# EAGLE design LFO (EAGLE 5.11)

## Sheet 1 of 2
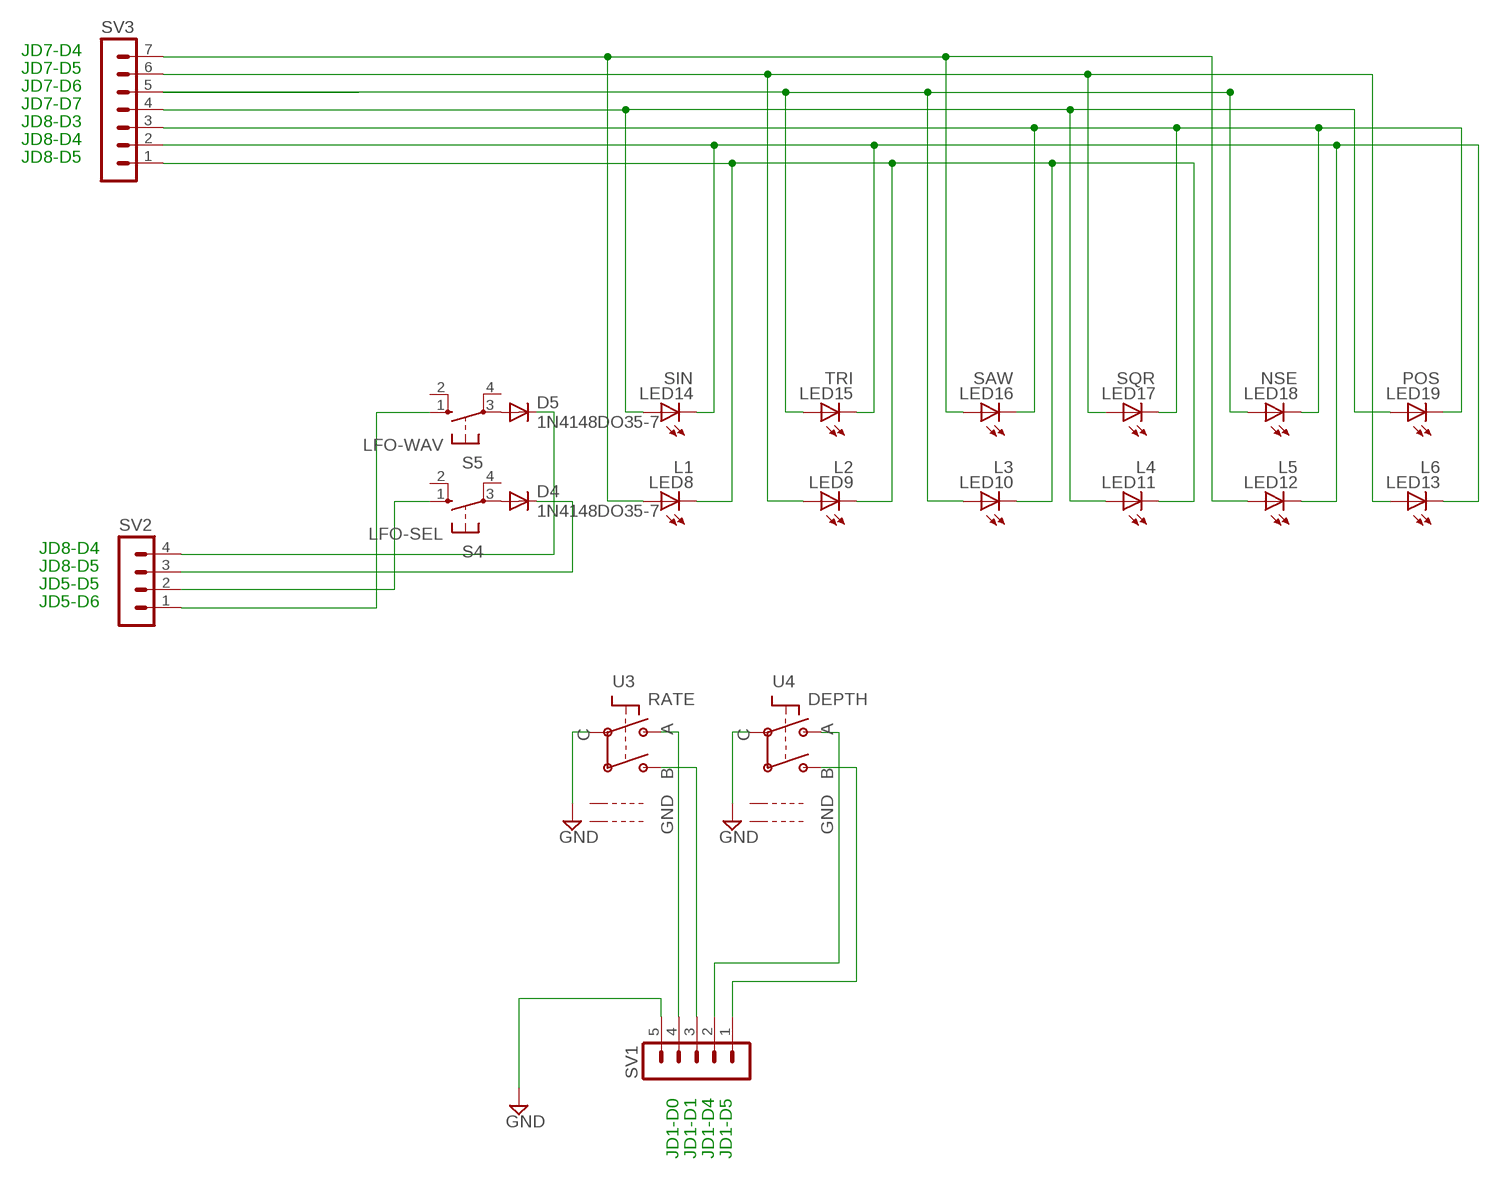
[diagram p0: schematic, sheet 1]

### Parts
D4  1N4148DO35-7  [DO35-7]
D5  1N4148DO35-7  [DO35-7]
LED8  L1  LED3MM  [LED3MM]
LED9  L2  LED3MM  [LED3MM]
LED10  L3  LED3MM  [LED3MM]
LED11  L4  LED3MM  [LED3MM]
LED12  L5  LED3MM  [LED3MM]
LED13  L6  LED3MM  [LED3MM]
LED14  SIN  LED3MM  [LED3MM]
LED15  TRI  LED3MM  [LED3MM]
LED16  SAW  LED3MM  [LED3MM]
LED17  SQR  LED3MM  [LED3MM]
LED18  NSE  LED3MM  [LED3MM]
LED19  POS  LED3MM  [LED3MM]
S4  LFO-SEL  10-XX  [B3F-10XX]
S5  LFO-WAV  10-XX  [B3F-10XX]
SV1  MA05-1  [MA05-1]
SV2  MA04-1  [MA04-1]
SV3  MA07-1  [MA07-1]
U3  RATE  ENC_ALPS_STEC16  [STEC16]
U4  DEPTH  ENC_ALPS_STEC16  [STEC16]

### Nets
GND: SV1.5 U3.P$C U4.P$C
N$6: SV1.4 U3.P$A
N$7: SV1.3 U3.P$B
N$8: S4.1(S) SV2.2
N$9: SV1.2 U4.P$A
N$10: SV1.1 U4.P$B
N$12: D4.A S4.3(P)
N$13: S5.1(S) SV2.1
N$17: D5.C SV2.4
N$18: D5.A S5.3(P)
N$21: LED8.A LED12.A LED16.A SV3.7
N$22: LED9.A LED13.A LED17.A SV3.6
N$23: LED10.A LED15.A LED18.A SV3.5
N$24: D4.C SV2.3
N$25: LED8.K(C) LED9.K(C) LED10.K(C) LED11.K(C) SV3.1
N$26: LED16.K(C) LED17.K(C) LED18.K(C) LED19.K(C) SV3.3
N$27: LED11.A LED14.A LED19.A SV3.4
N$32: LED12.K(C) LED13.K(C) LED14.K(C) LED15.K(C) SV3.2
Unconnected: S4.2(S1) S4.4(P1) S5.2(S1) S5.4(P1) U3.P$GND1 U3.P$GND2 U4.P$GND1 U4.P$GND2

### Notes on the sheet
- JD7-D4
- JD7-D5
- JD7-D6
- JD7-D7
- JD8-D3
- JD8-D4
- JD8-D5
- JD8-D4
- JD8-D5
- JD5-D5
- JD5-D6
- JD1-D0 | JD1-D1 | JD1-D4 | JD1-D5

## Sheet 2 of 2

## Library data of the parts
D4 D5 = diode:1N4148: DIODE high speed (Philips)
LED8-LED19 = led:LED: LED OSRAM: - CHIPLED LG R971, LG N971, LY N971, LG Q971, LY Q971, LO R971, LY R971 LH N974, LH R974 LS Q976, LO Q976, LY Q976 LO Q996 - Hyper CHIPLED LW Q18S LB Q993, LB Q99A, LB R99A - SideLED LS A670, LO A670, LY A670, LG A670, LP A670 LB A673, LV A673, LT A673, LW A673 LH A674 LY A675 LS A676, LA A676, LO A676, LY A676, LW A676 LS A679, LY A679, LG A679 - Hyper Micro SIDELED® LS Y876, LA Y876, LO Y876, LY Y876 LT Y87S - SmartLED LW L88C, LW L88S LB L89C, LB L89S, LG L890 LS L89K, LO L89K, LY L89K LS L896, LA L896, LO L896, LY L896 - TOPLED LS T670, LO T670, LY T670, LG T670, LP T670 LSG T670, LSP T670, LSY T670, LOP T670, LYG T670 LG T671, LOG T671, LSG T671 LB T673, LV T673, LT T673, LW T673 LH T674 LS T676, LA T676, LO T676, LY T676, LB T676, LH T676, LSB T676, LW T676 LB T67C, LV T67C, LT T67C, LS T67K, LO T67K, LY T67K, LW E67C LS E67B, LA E67B, LO E67B, LY E67B, LB E67C, LV E67C, LT E67C LW T67C LS T679, LY T679, LG T679 LS T770, LO T770, LY T770, LG T770, LP T770 LB T773, LV T773, LT T773, LW T773 LH T774 LS E675, LA E675, LY E675, LS T675 LS T776, LA T776, LO T776, LY T776, LB T776 LHGB T686 LT T68C, LB T68C - Hyper Mini TOPLED® LB M676 - Mini TOPLED Santana® LG M470 LS M47K, LO M47K, LY M47K Source: http://www.osram.convergy.de LUXEON: - LUMILED® LXK2-PW12-R00, LXK2-PW12-S00, LXK2-PW14-U00, LXK2-PW14-V00 LXK2-PM12-R00, LXK2-PM12-S00, LXK2-PM14-U00 LXK2-PE12-Q00, LXK2-PE12-R00, LXK2-PE12-S00, LXK2-PE14-T00, LXK2-PE14-U00 LXK2-PB12-K00, LXK2-PB12-L00, LXK2-PB12-M00, LXK2-PB14-N00, LXK2-PB14-P00, LXK2-PB14-Q00 LXK2-PR12-L00, LXK2-PR12-M00, LXK2-PR14-Q00, LXK2-PR14-R00 LXK2-PD12-Q00, LXK2-PD12-R00, LXK2-PD12-S00 LXK2-PH12-R00, LXK2-PH12-S00 LXK2-PL12-P00, LXK2-PL12-Q00, LXK2-PL12-R00 Source: www.luxeon.com KINGBRIGHT: KA-3528ASYC Source: www.kingbright.com
S4 S5 = switch-omron:10-XX: OMRON SWITCH; MPN: B3F-1000; OC_FARNELL: 176432; OC_NEWARK: 36M3542
SV1 = con-lstb:MA05-1: PIN HEADER; OC_FARNELL: unknown; OC_NEWARK: unknown
SV2 = con-lstb:MA04-1: PIN HEADER; OC_FARNELL: unknown; OC_NEWARK: unknown
SV3 = con-lstb:MA07-1: PIN HEADER; OC_FARNELL: unknown; OC_NEWARK: unknown
U3 U4 = encoder:ENC

## Board
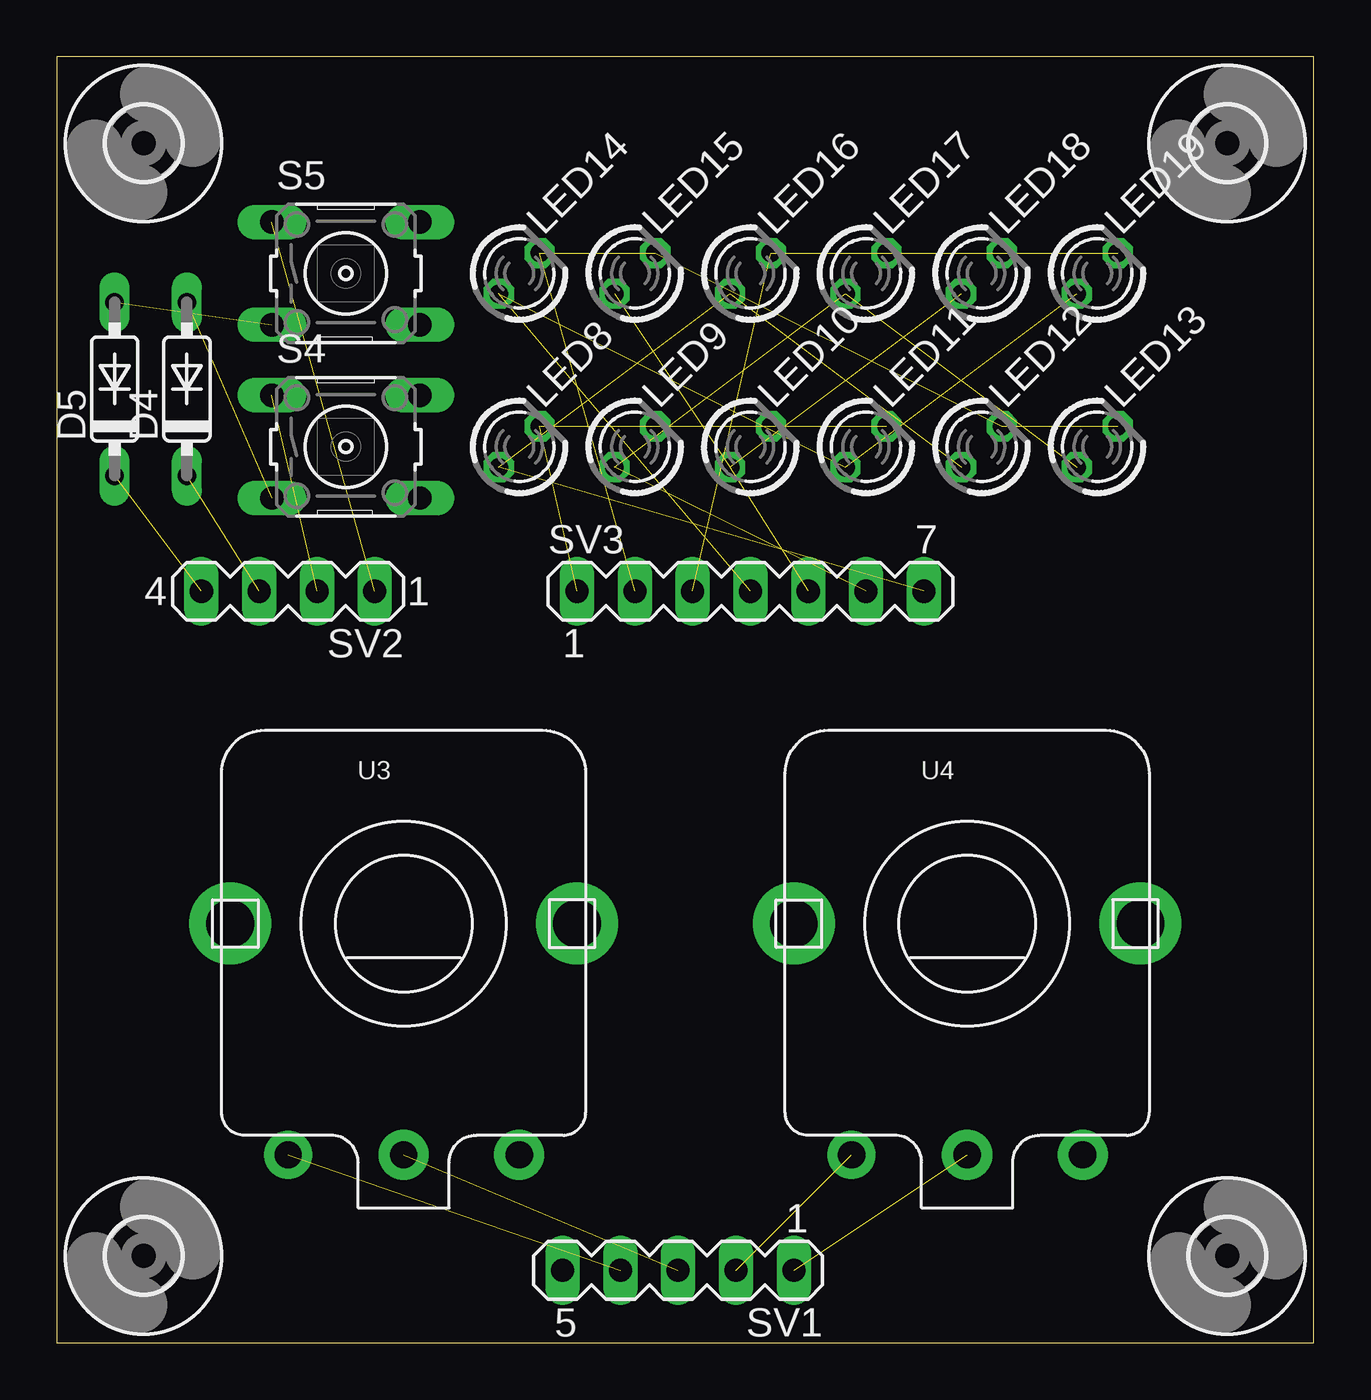
[diagram p1: board, top side]
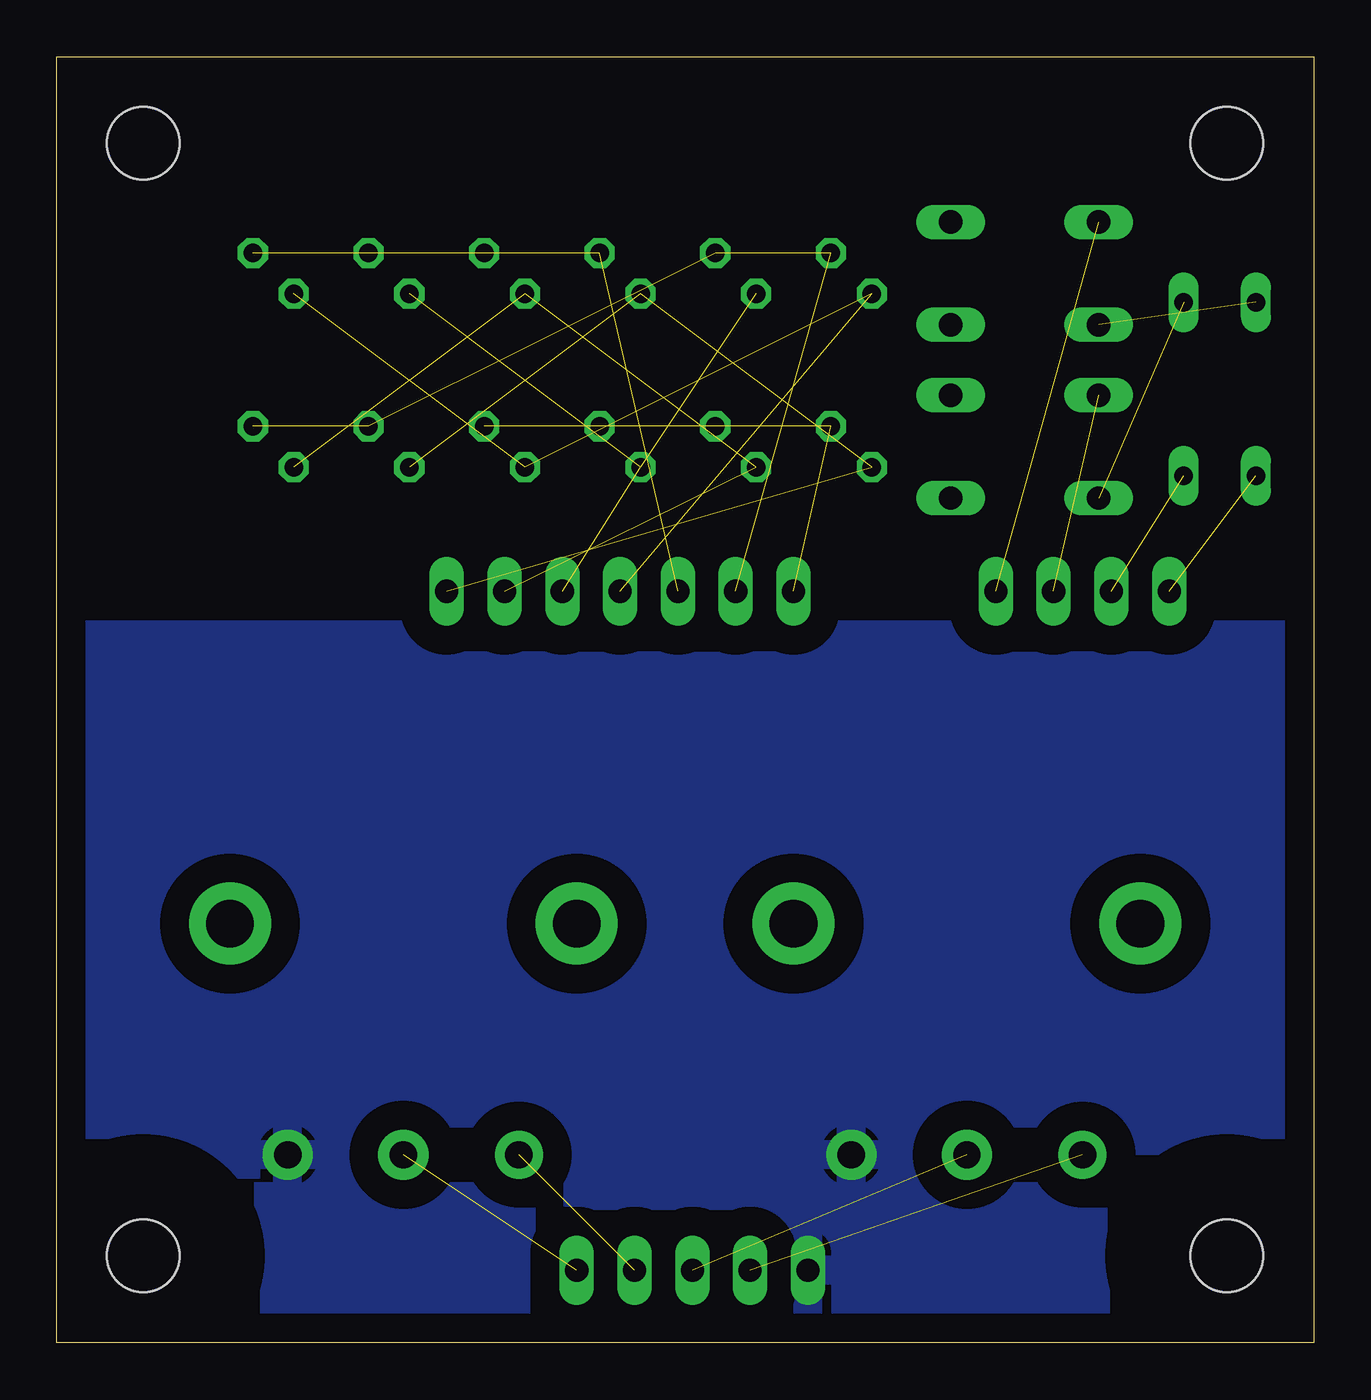
[diagram p2: board, bottom side, seen from below]

Size 55.23 x 56.51 mm. Coordinates in mm from the lower left corner, seen from the top.
Outline: 0,0 55.23,0 55.23,56.51 0,56.51 0,0
Copper layers (1*16): Top 0.035mm / dielectric 1.5mm / Bottom 0.035mm
Design rules "default": minimum track width 10mil, minimum drill 24mil, track to track 8mil, track to pad 8mil, pad to pad 8mil, via to via 8mil, smd to smd 8mil, copper to edge 40mil, drill to drill 8mil, minimum pad ring 10mil, minimum via ring 8mil, stop-mask expansion 4mil, vias tented up to drill 0mil, thermal gap 10mil

### Footprints (pad centres in the part's own frame; a part is rotated, then mirrored left to right if it is on the bottom)
DO35-7 = drill 0.813 long: A 3.81,0; C -3.81,0
LED3MM = drill 0.813 octagon: A -1.27,0; K 1.27,0
B3F-10XX = drill 1.016 long: 1 -3.251,2.261; 2 3.251,2.261; 3 -3.251,-2.261; 4 3.251,-2.261
MA05-1 = drill 1.016 long: 1 -5.08,0; 2 -2.54,0; 3 0,0; 4 2.54,0; 5 5.08,0
MA04-1 = drill 1.016 long: 1 -3.81,0; 2 -1.27,0; 3 1.27,0; 4 3.81,0
MA07-1 = drill 1.016 long: 1 -7.62,0; 2 -5.08,0; 3 -2.54,0; 4 0,0; 5 2.54,0; 6 5.08,0; 7 7.62,0
STEC16 = drill 1.2 pad 2.1 round: P$A -5.08,-10.16 | drill 1.2 pad 2.2 round: P$B 0,-10.16; P$C 5.08,-10.16 | drill 2.1 pad 3.6 round: P$GND1 -7.62,0; P$GND2 7.62,0
3,2 = hole 3.2: 0,0

### Placement (x,y rotation side)
D4  5.71,41.91 90 top
D5  2.54,41.91 90 top
LED8  20.32,39.37 45 top
LED9  25.4,39.37 45 top
LED10  30.48,39.37 45 top
LED11  35.56,39.37 45 top
LED12  40.64,39.37 45 top
LED13  45.72,39.37 45 top
LED14  20.32,46.99 45 top
LED15  25.4,46.99 45 top
LED16  30.48,46.99 45 top
LED17  35.56,46.99 45 top
LED18  40.64,46.99 45 top
LED19  45.72,46.99 45 top
S4  12.7,39.37 0 top
S5  12.7,46.99 0 top
SV1  27.3,3.17 180 top
SV2  10.16,33.02 180 top
SV3  30.48,33.02 0 top
U3  15.24,18.41 0 top
U4  40.01,18.41 0 top
U$1  [3,2]  3.81,3.81 0 top
U$2  [3,2]  51.44,3.81 0 top
U$3  [3,2]  3.81,52.7 0 top
U$4  [3,2]  51.44,52.7 0 top

### Tracks (layer width: path | path; a pad name or v marks a point on that pad's centre or on a via)
GND
  pour Bottom (isolate 1.27): -1.27,31.11 -1.27,-1.27 146.05,-1.27 146.05,31.11
N$6  (1 unrouted)
N$7  (1 unrouted)
N$8  (1 unrouted)
N$9  (1 unrouted)
N$10  (1 unrouted)
N$12  (1 unrouted)
N$13  (1 unrouted)
N$17  (1 unrouted)
N$18  (1 unrouted)
N$21  (3 unrouted)
N$22  (3 unrouted)
N$23  (3 unrouted)
N$24  (1 unrouted)
N$25  (4 unrouted)
N$26  (4 unrouted)
N$27  (3 unrouted)
N$32  (4 unrouted)